# EAGLE schematic CPU68K_v3.2.1 (EAGLE 5.06)
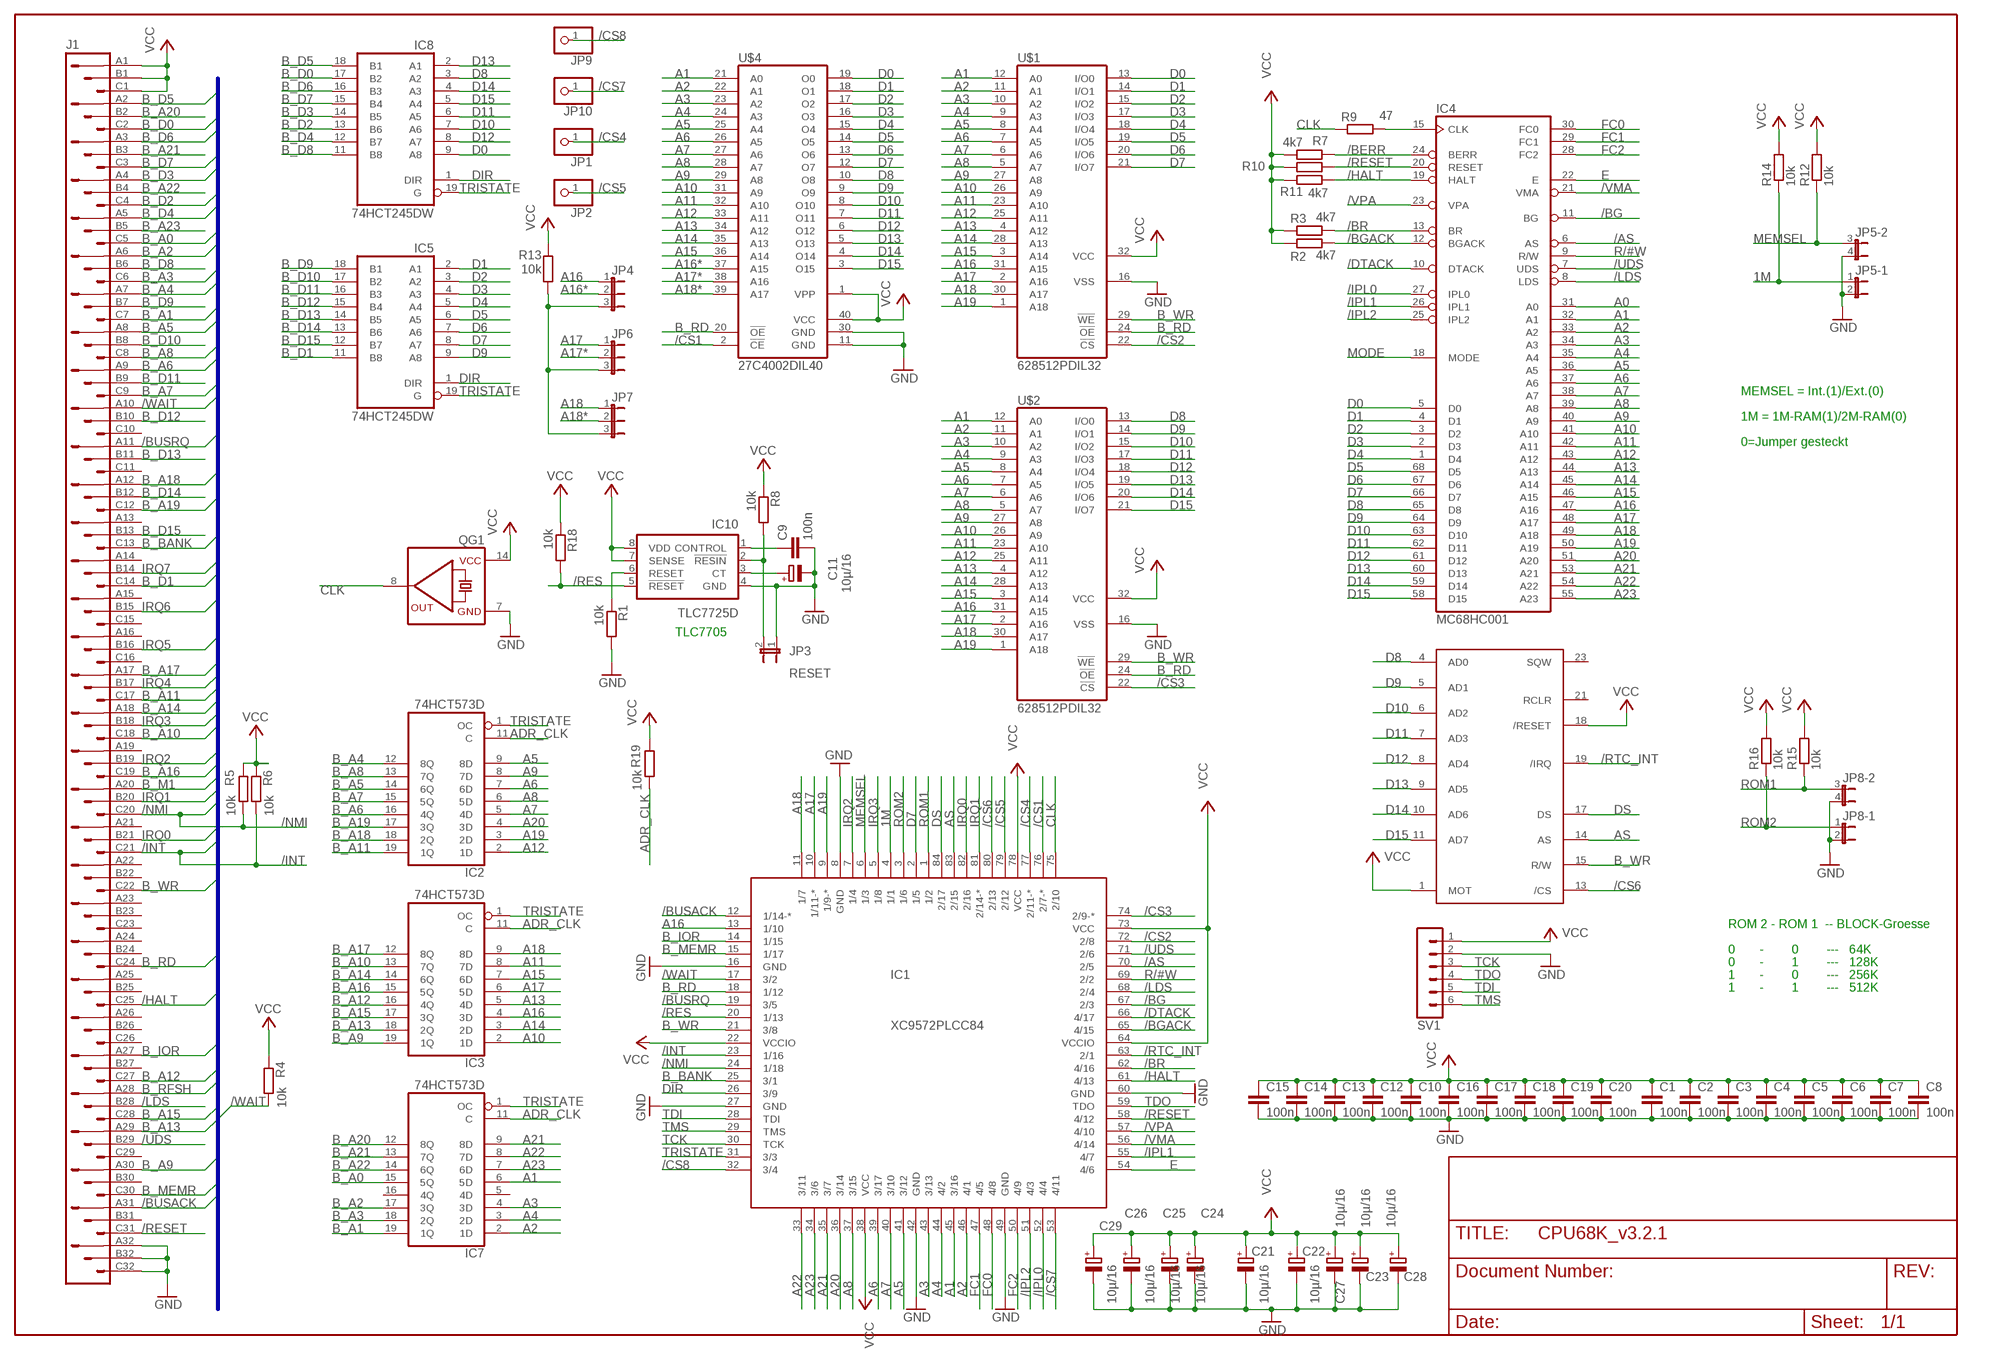
[diagram p0: schematic, sheet 1]

## Parts
C1  100n  C-EUC1206  [C1206]
C2  100n  C-EUC1206  [C1206]
C3  100n  C-EUC1206  [C1206]
C4  100n  C-EUC1206  [C1206]
C5  100n  C-EUC1206  [C1206]
C6  100n  C-EUC1206  [C1206]
C7  100n  C-EUC1206  [C1206]
C8  100n  C-EUC1206  [C1206]
C9  100n  C-EUC1206  [C1206]
C10  100n  C-EUC1206  [C1206]
C11  10µ/16  CPOL-EUSMCC  [SMC_C]
C12  100n  C-EUC1206  [C1206]
C13  100n  C-EUC1206  [C1206]
C14  100n  C-EUC1206  [C1206]
C15  100n  C-EUC1206  [C1206]
C16  100n  C-EUC1206  [C1206]
C17  100n  C-EUC1206  [C1206]
C18  100n  C-EUC1206  [C1206]
C19  100n  C-EUC1206  [C1206]
C20  100n  C-EUC1206  [C1206]
C21  10µ/16  CPOL-EUSMCC  [SMC_C]
C22  10µ/16  CPOL-EUSMCC  [SMC_C]
C23  10µ/16  CPOL-EUSMCC  [SMC_C]
C24  10µ/16  CPOL-EUSMCC  [SMC_C]
C25  10µ/16  CPOL-EUSMCC  [SMC_C]
C26  10µ/16  CPOL-EUSMCC  [SMC_C]
C27  10µ/16  CPOL-EUSMCC  [SMC_C]
C28  10µ/16  CPOL-EUSMCC  [SMC_C]
C29  10µ/16  CPOL-EUSMCC  [SMC_C]
IC1  XC9572PLCC84  [S84]
IC2  74HCT573D  [SO20W]
IC3  74HCT573D  [SO20W]
IC4  MC68HC001  [PLCC68-S]
IC5  74HCT245DW  [SO20W]
IC7  74HCT573D  [SO20W]
IC8  74HCT245DW  [SO20W]
IC10  TLC7725D  [DIL08]
J1  VG96P  [VG96P]
JP1  PINHD-1X1  [1X01]
JP2  PINHD-1X1  [1X01]
JP3  RESET  JP1E  [JP1]
JP4  JP2E  [JP2]
JP5  JP2QE  [JP2Q]
JP6  JP2E  [JP2]
JP7  JP2E  [JP2]
JP8  JP2QE  [JP2Q]
JP9  PINHD-1X1  [1X01]
JP10  PINHD-1X1  [1X01]
QG1  QG5860  [DIL14S]
R1  10k  R-EU_M1206  [M1206]
R2  4k7  R-EU_M1206  [M1206]
R3  4k7  R-EU_M1206  [M1206]
R4  10k  R-EU_M1206  [M1206]
R5  10k  R-EU_M1206  [M1206]
R6  10k  R-EU_M1206  [M1206]
R7  4k7  R-EU_M1206  [M1206]
R8  10k  R-EU_M1206  [M1206]
R9  47  R-EU_M1206  [M1206]
R10  4k7  R-EU_M1206  [M1206]
R11  3K3  R-EU_M1206  [M1206]
R12  10k  R-EU_M1206  [M1206]
R13  10k  R-EU_M1206  [M1206]
R14  10k  R-EU_M1206  [M1206]
R15  10k  R-EU_M1206  [M1206]
R16  10k  R-EU_M1206  [M1206]
R18  10k  R-EU_M1206  [M1206]
R19  10k  R-EU_M1206  [M1206]
SV1  MA06-1  [MA06-1]
U$1  628512PDIL32  [DIL32]
U$2  628512PDIL32  [DIL32]
U$3  DS12C887DIL24  [DIL24]
U$4  27C4002DIL40  [DIL40]

## Nets
1M: IC1.4(1/1) JP5.1 R14.1
/AS: IC1.70(2/5) IC4.6(AS)
/BERR: IC4.24(BERR) R7.1
/BG: IC1.67(2/3) IC4.11(BG)
/BGACK: IC1.65(4/15) IC4.12(BGACK) R2.1
/BR: IC1.62(4/16) IC4.13(BR) R3.1
/BUSACK: IC1.12(1/14-*) J1.A31
/BUSRQ: IC1.19(3/5) J1.A11
/CS1: IC1.76(2/7-*) U$4.2(!CE)
/CS2: IC1.72(2/8) U$1.22(!CS)
/CS3: IC1.74(2/9-*) U$2.22(!CS)
/CS4: IC1.77(2/11-*) JP1.1
/CS5: IC1.79(2/12) JP2.1
/CS6: IC1.80(2/13) U$3.13(/CS)
/CS7: IC1.53(4/11) JP10.1
/CS8: IC1.32(3/4) JP9.1
/DTACK: IC1.66(4/17) IC4.10(DTACK)
/HALT: IC1.61(4/13) IC4.19(HALT) J1.C25 R11.1
/INT: IC1.23(1/16) J1.C21 R6.1
/IPL0: IC1.52(4/4) IC4.27(IPL0)
/IPL1: IC1.55(4/7) IC4.26(IPL1)
/IPL2: IC1.51(4/3) IC4.25(IPL2)
/LDS: IC1.68(2/4) IC4.8(LDS) J1.B28
/NMI: IC1.24(1/18) J1.C20 R5.1
/RES: IC1.20(1/13) IC10.5(!RESET) R18.2
/RESET: IC1.58(4/12) IC4.20(RESET) J1.C31 R10.1
/RTC_INT: IC1.63(2/1) U$3.19(/IRQ)
/UDS: IC1.71(2/6) IC4.7(UDS) J1.B29
/VMA: IC1.56(4/14) IC4.21(VMA)
/VPA: IC1.57(4/10) IC4.23(VPA)
/WAIT: IC1.17(3/2) J1.A10 R4.1
A0: IC4.31(A0)
A1: IC1.45(3/16) IC4.32(A1) IC7.6(5D) U$1.12(A0) U$2.12(A0) U$4.21(A0)
A2: IC1.46(4/1) IC4.33(A2) IC7.2(1D) U$1.11(A1) U$2.11(A1) U$4.22(A1)
A3: IC1.43(3/13) IC4.34(A3) IC7.4(3D) U$1.10(A2) U$2.10(A2) U$4.23(A2)
A4: IC1.44(4/2) IC4.35(A4) IC7.3(2D) U$1.9(A3) U$2.9(A3) U$4.24(A3)
A5: IC1.41(3/12) IC2.9(8D) IC4.36(A5) U$1.8(A4) U$2.8(A4) U$4.25(A4)
A6: IC1.39(3/17) IC2.7(6D) IC4.37(A6) U$1.7(A5) U$2.7(A5) U$4.26(A5)
A7: IC1.40(3/10) IC2.5(4D) IC4.38(A7) U$1.6(A6) U$2.6(A6) U$4.27(A6)
A8: IC1.37(3/15) IC2.6(5D) IC4.39(A8) U$1.5(A7) U$2.5(A7) U$4.28(A7)
A9: IC2.8(7D) IC4.40(A9) U$1.27(A8) U$2.27(A8) U$4.29(A8)
A10: IC3.2(1D) IC4.41(A10) U$1.26(A9) U$2.26(A9) U$4.31(A9)
A11: IC3.8(7D) IC4.42(A11) U$1.23(A10) U$2.23(A10) U$4.32(A10)
A12: IC2.2(1D) IC4.43(A12) U$1.25(A11) U$2.25(A11) U$4.33(A11)
A13: IC3.5(4D) IC4.44(A13) U$1.4(A12) U$2.4(A12) U$4.34(A12)
A14: IC3.3(2D) IC4.45(A14) U$1.28(A13) U$2.28(A13) U$4.35(A13)
A15: IC3.7(6D) IC4.46(A15) U$1.3(A14) U$2.3(A14) U$4.36(A14)
A16: IC1.13(1/10) IC3.4(3D) IC4.47(A16) JP4.1 U$1.31(A15) U$2.31(A15)
A16*: JP4.2 U$4.37(A15)
A17: IC1.10(1/11-*) IC3.6(5D) IC4.48(A17) JP6.1 U$1.2(A16) U$2.2(A16)
A17*: JP6.2 U$4.38(A16)
A18: IC1.11(1/7) IC3.9(8D) IC4.49(A18) JP7.1 U$1.30(A17) U$2.30(A17)
A18*: JP7.2 U$4.39(A17)
A19: IC1.9(1/9-*) IC2.3(2D) IC4.50(A19) U$1.1(A18) U$2.1(A18)
A20: IC1.36(3/14) IC2.4(3D) IC4.51(A20)
A21: IC1.35(3/7) IC4.53(A21) IC7.9(8D)
A22: IC1.33(3/11) IC4.54(A22) IC7.8(7D)
A23: IC1.34(3/6) IC4.55(A23) IC7.7(6D)
ADR_CLK: IC2.11(C) IC3.11(C) IC7.11(C) R19.1
AS: IC1.83(2/15) U$3.14(AS)
B_A0: IC7.15(5Q) J1.C5
B_A1: IC7.19(1Q) J1.C7
B_A2: IC7.17(3Q) J1.A6
B_A3: IC7.18(2Q) J1.C6
B_A4: IC2.12(8Q) J1.A7
B_A5: IC2.14(6Q) J1.A8
B_A6: IC2.16(4Q) J1.A9
B_A7: IC2.15(5Q) J1.C9
B_A8: IC2.13(7Q) J1.C8
B_A9: IC3.19(1Q) J1.A30
B_A10: IC3.13(7Q) J1.C18
B_A11: IC2.19(1Q) J1.C17
B_A12: IC3.16(4Q) J1.C27
B_A13: IC3.18(2Q) J1.A29
B_A14: IC3.14(6Q) J1.A18
B_A15: IC3.17(3Q) J1.C28
B_A16: IC3.15(5Q) J1.C19
B_A17: IC3.12(8Q) J1.A17
B_A18: IC2.18(2Q) J1.A12
B_A19: IC2.17(3Q) J1.C12
B_A20: IC7.12(8Q) J1.B2
B_A21: IC7.13(7Q) J1.B3
B_A22: IC7.14(6Q) J1.B4
B_A23: J1.B5
B_BANK: IC1.25(3/1) J1.C13
B_D0: IC8.17(B2) J1.C2
B_D1: IC5.11(B8) J1.C14
B_D2: IC8.13(B6) J1.C4
B_D3: IC8.14(B5) J1.A4
B_D4: IC8.12(B7) J1.A5
B_D5: IC8.18(B1) J1.A2
B_D6: IC8.16(B3) J1.A3
B_D7: IC8.15(B4) J1.C3
B_D8: IC8.11(B8) J1.B6
B_D9: IC5.18(B1) J1.B7
B_D10: IC5.17(B2) J1.B8
B_D11: IC5.16(B3) J1.B9
B_D12: IC5.15(B4) J1.B10
B_D13: IC5.14(B5) J1.B11
B_D14: IC5.13(B6) J1.B12
B_D15: IC5.12(B7) J1.B13
B_IOR: IC1.14(1/15) J1.A27
B_M1: J1.A20
B_MEMR: IC1.15(1/17) J1.C30
B_RD: IC1.18(1/12) J1.C24 U$1.24(!OE) U$2.24(!OE) U$4.20(!OE)
B_RFSH: J1.A28
B_WR: IC1.21(3/8) J1.C22 U$1.29(!WE) U$2.29(!WE) U$3.15(R/W)
CLK: IC1.75(2/10) QG1.8(OUT) R9.2
D0: IC4.5(D0) IC8.9(A8) U$1.13(I/O0) U$4.19(O0)
D1: IC4.4(D1) IC5.2(A1) U$1.14(I/O1) U$4.18(O1)
D2: IC4.3(D2) IC5.3(A2) U$1.15(I/O2) U$4.17(O2)
D3: IC4.2(D3) IC5.4(A3) U$1.17(I/O3) U$4.16(O3)
D4: IC4.1(D4) IC5.5(A4) U$1.18(I/O4) U$4.15(O4)
D5: IC4.68(D5) IC5.6(A5) U$1.19(I/O5) U$4.14(O5)
D6: IC4.67(D6) IC5.7(A6) U$1.20(I/O6) U$4.13(O6)
D7: IC1.2(1/5) IC4.66(D7) IC5.8(A7) U$1.21(I/O7) U$4.12(O7)
D8: IC4.65(D8) IC8.3(A2) U$2.13(I/O0) U$3.4(AD0) U$4.10(O8)
D9: IC4.64(D9) IC5.9(A8) U$2.14(I/O1) U$3.5(AD1) U$4.9(O9)
D10: IC4.63(D10) IC8.7(A6) U$2.15(I/O2) U$3.6(AD2) U$4.8(O10)
D11: IC4.62(D11) IC8.6(A5) U$2.17(I/O3) U$3.7(AD3) U$4.7(O11)
D12: IC4.61(D12) IC8.8(A7) U$2.18(I/O4) U$3.8(AD4) U$4.6(O12)
D13: IC4.60(D13) IC8.2(A1) U$2.19(I/O5) U$3.9(AD5) U$4.5(O13)
D14: IC4.59(D14) IC8.4(A3) U$2.20(I/O6) U$3.10(AD6) U$4.4(O14)
D15: IC4.58(D15) IC8.5(A4) U$2.21(I/O7) U$3.11(AD7) U$4.3(O15)
DIR: IC1.26(3/9) IC5.1(DIR) IC8.1(DIR)
DS: IC1.84(2/17) U$3.17(DS)
E: IC1.54(4/6) IC4.22(E)
FC0: IC1.48(4/8) IC4.30(FC0)
FC1: IC1.47(4/5) IC4.29(FC1)
FC2: IC1.50(4/9) IC4.28(FC2)
GND: C1.2 C2.2 C3.2 C4.2 C5.2 C6.2 C7.2 C8.2 C9.2 C10.2 C11.- C12.2 C13.2 C14.2 C15.2 C16.2 C17.2 C18.2 C19.2 C20.2 C21.- C22.- C23.- C24.- C25.- C26.- C27.- C28.- C29.- IC1.8(GND) IC1.16(GND) IC1.27(GND) IC1.42(GND) IC1.49(GND) IC1.60(GND) IC10.4(GND) J1.A32 J1.B32 J1.C32 JP3.1 JP5.2 JP5.4 JP8.2 JP8.4 QG1.7(GND) R1.2 SV1.2 U$1.16(VSS) U$2.16(VSS) U$4.11(GND) U$4.30(GND)
IRQ0: IC1.82(2/16) J1.B21
IRQ1: IC1.81(2/14-*) J1.B20
IRQ2: IC1.7(1/4) J1.B19
IRQ3: IC1.5(1/8) J1.B18
IRQ4: J1.B17
IRQ5: J1.B16
IRQ6: J1.B15
IRQ7: J1.B14
MEMSEL: IC1.6(1/3) JP5.3 R12.1
MODE: IC4.18(MODE)
N$1: IC10.6(RESET) R1.1
N$2: JP4.3 JP6.3 JP7.3 R13.1
N$4: C11.+ IC10.3(CT)
N$6: C9.1 IC10.1(CONTROL)
N$7: IC10.2(!RESIN) JP3.2 R8.2
N$424: IC4.15(CLK) R9.1
R/#W: IC1.69(2/2) IC4.9(R/W)
ROM1: IC1.1(1/2) JP8.3 R15.1
ROM2: IC1.3(1/6) JP8.1 R16.1
TCK: IC1.30(TCK) SV1.3
TDI: IC1.28(TDI) SV1.5
TDO: IC1.59(TDO) SV1.4
TMS: IC1.29(TMS) SV1.6
TRISTATE: IC1.31(3/3) IC2.1(OC) IC3.1(OC) IC5.19(G) IC7.1(OC) IC8.19(G)
VCC: C1.1 C2.1 C3.1 C4.1 C5.1 C6.1 C7.1 C8.1 C10.1 C12.1 C13.1 C14.1 C15.1 C16.1 C17.1 C18.1 C19.1 C20.1 C21.+ C22.+ C23.+ C24.+ C25.+ C26.+ C27.+ C28.+ C29.+ IC1.22(VCCIO) IC1.38(VCC) IC1.64(VCCIO) IC1.73(VCC) IC1.78(VCC) IC10.7(SENSE) IC10.8(VDD) J1.A1 J1.B1 J1.C1 QG1.14(VCC) R2.2 R3.2 R4.2 R5.2 R6.2 R7.2 R8.1 R10.2 R11.2 R12.2 R13.2 R14.2 R15.2 R16.2 R18.1 R19.2 SV1.1 U$1.32(VCC) U$2.32(VCC) U$3.1(MOT) U$3.18(/RESET) U$4.1(VPP) U$4.40(VCC)
Unconnected: IC7.5(4D) IC7.16(4Q) J1.A13 J1.A14 J1.A15 J1.A16 J1.A19 J1.A21 J1.A22 J1.A23 J1.A24 J1.A25 J1.A26 J1.B22 J1.B23 J1.B24 J1.B25 J1.B26 J1.B27 J1.B30 J1.B31 J1.C10 J1.C11 J1.C15 J1.C16 J1.C23 J1.C26 J1.C29 U$3.21(RCLR) U$3.23(SQW)

## Buses
B_D[0..7],B_A[0..23],IRQ[0..7],B_BANK,B_HALT,B_RD,B_WR,B_IOR,B_MEMR,B_M1,B_RFSH,B_BACK,/INT,/NMI,/RESET,/WAIT,/BUSRQ,CLK

## Notes on the sheet
- MEMSEL = Int.(1)/Ext.(0)
- 1M = 1M-RAM(1)/2M-RAM(0)
- 0=Jumper gesteckt
- TLC7705
- ROM 2 - ROM 1  -- BLOCK-Groesse
- 0       -        0        ---   64K
- 0       -        1        ---   128K
- 1       -        0        ---   256K
- 1       -        1        ---   512K

## Power pins joined to a net without a drawn wire
GND: IC2.10(GND) IC3.10(GND) IC4.16(GND) IC4.17(GND) IC4.56(GND) IC4.57(GND) IC5.10(GND) IC7.10(GND) IC8.10(GND) U$3.12(GND)
VCC: IC2.20(VCC) IC3.20(VCC) IC4.14(VCC) IC4.52(VCC) IC5.20(VCC) IC7.20(VCC) IC8.20(VCC) U$3.24(VCC)

## Library data of the parts
C1-C10 C12-C20 = rcl:C-EU: CAPACITOR, European symbol
C11 C21-C29 = rcl:CPOL-EU: POLARIZED CAPACITOR, European symbol
IC1 = Xilinx:XC9572
IC2 IC3 IC7 = 74xx-eu:74*573: 8-bit D latch BUS DRIVER
IC4 = micro-mc68000:MC68HC001
IC5 IC8 = 74xx-eu:74*245: Octal BUS TRANSCEIVER, 3-state
IC10 = texas:TLC77*: MICROPOWER SUPPLY VOLTAGE SUPERVISORS Source: www.ti.com/.. slvs087l.pdf
J1 = 19inch:VG96: PCB EUROCARD, 96-pin type C/ABC, 2.54 mm
JP1 JP2 JP9 JP10 = pinhead:PINHD-1X1: PIN HEADER
JP3 = jumper:JP1E: JUMPER
JP4 JP6 JP7 = jumper:JP2E: JUMPER
JP5 JP8 = jumper:JP2QE: JUMPER
QG1 = crystal:QG5860: CRYSTAL RESONATOR
R1-R16 R18 R19 = rcl:R-EU_: RESISTOR, European symbol
SV1 = con-lstb:MA06-1: PIN HEADER
U$1 U$2 = memory-hitachi:628512P
U$3 = DALLAS:DS12C887
U$4 = memory-nec:27C4002